# Altium schematic sheet Switch.SchDoc
size A4; SheetNumber: 36; SheetTotal: 37
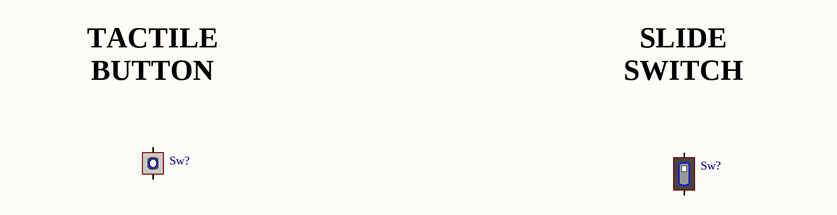
[diagram p0: Switch.SchDoc]

## Parts
(Parts that share a designator on the sheet are numbered #1, #2 ... from top to bottom, then left to right.)
Sw?#1  Tactile, SPST  [Tactile, SPST - Panasonic, EVQQ2]  (value not drawn)
Sw?#2  Slide, SPST  [Slide, SPST - C&K, SDA01HxS]  (value not drawn)

## Nets

Not connected (* = marked no-connect by the designer): Sw?#1 A B; Sw?#2 A B

## Notes on the sheet
- (near Sw?#1) TACTILE
  BUTTON
- SLIDE
  SWITCH

## Library data of the parts
Sw?#1 = Tactile, SPST: Switch, Tactile, SPST, SMD; Manufacturer: Panasonic; Manufacturer Part Number: EVQ-Q2K03W; ComponentLink1Description: Datasheet; ComponentLink1URL: E:\Altium\Datasheets\Switch\Tactile, SPST - Panasonic, EVQP0, EVQQ2, EVQ6Q2, EVQ7Q2, EVPBT Series.pdf; ComponentLink2Description: Supplier Link; ComponentLink2URL: https://www.digikey.com/en/products/detail/panasonic-electronic-components/EVQ-Q2K03W/762893; Supplier: Digikey; Supplier Part Number: P12943SCT-ND; Operating Temperature, Min: -40℃; Operating Temperature, Max: +85℃; Quantity, Min: 1; Quantity, Max: 10000; Price, Min: 0.32; Supplier Currency: $; Price, Max: 0.16174; Supplier Link: https://www.digikey.com/en/products/detail/panasonic-electronic-components/EVQ-Q2K03W/762893; Component Type: Tactile; Component Category: Switch; Package: SMD
Sw?#2 = Slide, SPST: Switch, Slide, SPST, SMD; Manufacturer: C&K; Manufacturer Part Number: SDA01H1SBD; ComponentLink1Description: Datasheet; ComponentLink1URL: E:\Altium\Datasheets\Switch\Slide, SPST - C&K, SDA Series.pdf; ComponentLink2Description: Supplier Link; ComponentLink2URL: https://www.digikey.com/en/products/detail/c-k/SDA01H1SBD/2263273; Supplier: Digikey; Supplier Part Number: CKN10358-ND; Operating Temperature, Min: -40℃; Operating Temperature, Max: +85℃; Quantity, Min: 1; Quantity, Max: 5000; Price, Min: 1.34; Supplier Currency: $; Price, Max: 0.69803; Supplier Link: https://www.digikey.com/en/products/detail/c-k/SDA01H1SBD/2263273; Component Type: Slide; Component Category: Switch; Package: SMD